# Altium schematic sheet OZ440-SE140-CAR001_sheet3_Power_Switch.SchDoc
size A3
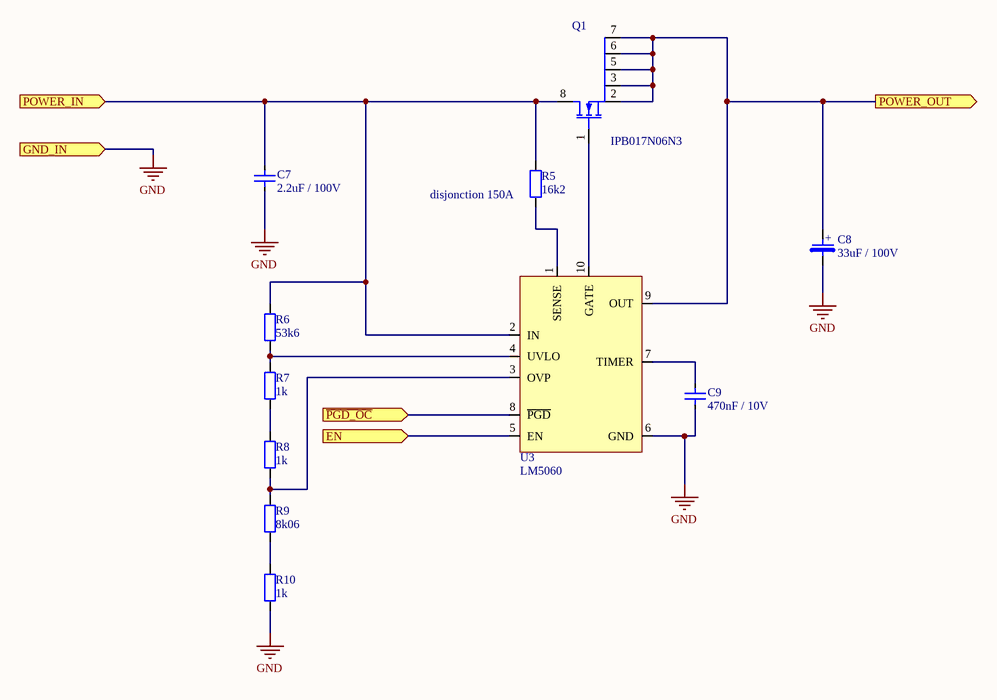
[diagram p0: OZ440-SE140-CAR001_sheet3_Power_Switch.SchDoc]

## Parts
C7  Displayed reference: 2.2uF / 100V  [C1206-STD]  (hidden comment: CAP-SMD)
C8  Displayed reference: 33uF / 100V  [CAP-ELECTRO-SMD_SIZE_G]  (hidden comment: CAP-POL-SMD)
C9  Displayed reference: 470nF / 10V  [C0603-STD]  (hidden comment: CAP-SMD)
Q1  Displayed reference: IPB017N06N3  [TO263-3-SPE-IPB039N10N3]  (hidden comment: IPB039N10N3-PGTO263_3)
R5  Displayed reference: 16k2  [R0805-STD]  (hidden comment: RES-SMD)
R6  Displayed reference: 53k6  [R0805-STD]  (hidden comment: RES-SMD)
R7  Displayed reference: 1k  [R0805-STD]  (hidden comment: RES-SMD)
R8  Displayed reference: 1k  [R0805-STD]  (hidden comment: RES-SMD)
R9  Displayed reference: 8k06  [R0805-STD]  (hidden comment: RES-SMD)
R10  Displayed reference: 1k  [R0805-STD]  (hidden comment: RES-SMD)
U3  Displayed reference: LM5060  [VSSOP10-SPE-LM5060]  (hidden comment: LM5060-VSSOP10)

## Ports
EN (in), GND_IN (in), POWER_IN (in), POWER_OUT (out), ~{PGD_OC} (in)

## Nets
GND: C7.1 C8.2 C9.1 R10.1 U3.6(GND) ; port GND_IN
~{PGD_OC}: U3.8(~{PGD}) ; port ~{PGD_OC}
EN: U3.5(EN) ; port EN
POWER_IN: C7.2 Q1.8(S) R5.2 R6.2 U3.2(IN) ; port POWER_IN
POWER_OUT: C8.1 Q1.2(D) Q1.3(D) Q1.5(D) Q1.6(D) Q1.7(D) U3.9(OUT) ; port POWER_OUT
NetC9_2: C9.2 U3.7(TIMER)
NetQ1_1: Q1.1(G) U3.10(GATE)
NetR5_1: R5.1 U3.1(SENSE)
NetR6_1: R6.1 R7.2 U3.4(UVLO)
NetR7_1: R7.1 R8.2
NetR8_1: R8.1 R9.2 U3.3(OVP)
NetR9_1: R9.1 R10.2

## Notes on the sheet
- (near R5) disjonction 150A
- Titre document:
- NAIO TECHNOLOGIES
- 3 Av didier Daurat
- 31400 TOULOUSE
- Auteur:
- Numéro document:
- Verificateur:
- Format:
- A3
- Date:
- Revision:
- Page:
- /
- (in symbol EEE2AA330P) +

## Library data of the parts
C7 = C3216X7S2A225Kxxx: 1206 2.2uF / 100V X7S ceramic capacitor; Manufacturer: TDK; Max Voltage: 100; Tolerance: +/- 10%; Validated: N; Reference: C3216X7S2A225Kxxx; Value: 2.2uF; Material: X7S; Footprint description: standard Capacitor 1206; Pin Count: 2; helpURL: http://www.mouser.com/ds/2/400/C3216X7S2A225K160AB-265429.pdf; Supplier 1: Mouser; Supplier Part Number 1: 810-C3216X7S2A225K; Supplier 2: Farnell; Supplier Part Number 2: 2112717
C8 = EEE2AA330P: 33uF / 100V Aluminium capacitor SMD; Manufacturer: Panasonic; Max Current: 0.05; Reference: EEE2AA330P; Value: 33uF; Max Voltage: 100V; Material: Aluminium; Footprint description: 10mmx10mm; Pin Count: 2; helpURL: http://industrial.panasonic.com/www-data/pdf/ABA0000/ABA0000CE2.pdf; Supplier 1: Farnell; Supplier Part Number 1: 1899628; Supplier 2: Mouser; Supplier Part Number 2: 667-EEE-2AA330P
C9 = 0603ZD474KAT2A: 0603 470nF / 10V X5R ceramic capacitor; Manufacturer: AVX; Max Voltage: 10; Tolerance: +/- 10%; Validated: N; Reference: 0603ZD474KAT2A; Value: 470nF; Material: X5R; Footprint description: standard Capacitor 0603; Pin Count: 2; helpURL: http://avx.com/docs/Catalogs/cx7r.pdf; Supplier 1: Farnell; Supplier Part Number 1: 1833805; Supplier 2: Mouser; Supplier Part Number 2: 581-0603ZD474KAT2A
Q1 = IPB017N06N3: 60V/180A N channel MOSFET in DPAK package; Manufacturer: INFINEON; Max Voltage: 60V; Max Current: 180A; Rated Power: 250W; Reference: IPB017N06N3; component type: NMOS; Footprint description: DPAK 8 pin; Pin Count: 8; Rev: 2.2; helpURL: https://www.infineon.com/dgdl/IPB017N06N3_Rev2.2.pdf?folderId=db3a30431441fb5d01148ca9f1be0e77&fileId=db3a30431ddc9372011e264a7ab746ea; Supplier 1: Farnell; Supplier Part Number 1: 1775519; Supplier 2: Mouser; Supplier Part Number 2: 726-IPB017N06N3G
R5 = CRCW080516K2FKxx: 16k2 Ohm 0805 SMD resistor; Manufacturer: Vishay; Value: 16200; Tolerance: 1%; Rated Power: 0.125W; Validated: No; Reference: CRCW080516K2FKxx; Footprint description: standard 0805 SMD; Pin Count: 2; helpURL: http://www.vishay.com/docs/20035/dcrcwe3.pdf; Supplier 1: Mouser; Supplier Part Number 1: 71-CRCW0805-16.2K-E3; Supplier 2: Farnell; Supplier Part Number 2: 1469878
R6 = CRCW080553K6FKxx: 53k6 Ohm 0805 SMD resistor; Manufacturer: Vishay; Value: 53600; Tolerance: 1%; Rated Power: 0.125W; Validated: No; Reference: CRCW080553K6FKxx; Footprint description: standard 0805 SMD; Pin Count: 2; helpURL: http://www.vishay.com/docs/20035/dcrcwe3.pdf; Supplier 1: Mouser; Supplier Part Number 1: 71-CRCW080553K6FKEA; Supplier 2: Farnell; Supplier Part Number 2: 1185098
R7 R8 R10 = CRCW08051K00FKxx: 1k Ohm 0805 SMD resistor; Manufacturer: Vishay; Value: 1 000; Tolerance: 1 %; Rated Power: 0,125 W; Validated: No; Reference: CRCW08051K00FKxx; Footprint description: standard 0805 SMD; Pin Count: 2; helpURL: http://www.vishay.com/docs/20035/dcrcwe3.pdf; Supplier 1: Farnell; Supplier Part Number 1: 1469847; Supplier 2: Mouser; Supplier Part Number 2: 71-CRCW0805-1.0K-E3
R9 = CRCW08058K06FKxx: 8k06 Ohm 0805 SMD resistor; Manufacturer: Vishay; Value: 8 060; Tolerance: 1%; Rated Power: 0.125W; Validated: No; Reference: CRCW08058K06FKxx; Footprint description: standard 0805 SMD; Pin Count: 2; helpURL: http://www.vishay.com/docs/20035/dcrcwe3.pdf; Supplier 1: Farnell; Supplier Part Number 1: 1653038; Supplier 2: Mouser; Supplier Part Number 2: 71-CRCW0805-8.06K-E3
U3 = LM5060MM: High-Side Protection Controller; Manufacturer: TI; Max Voltage: 65V; Validated: False; Reference: LM5060MM; Footprint description: VSSOP10; Pin Count: 10; Rev: 04/2013; helpURL: http://www.ti.com/lit/ds/symlink/lm5060.pdf; Supplier 1: Farnell; Supplier Part Number 1: 2383047; Supplier 2: Mouser; Supplier Part Number 2: 926-LM5060MM/NOPB